# Altium schematic sheet Sheet_1.schdoc
size 303 x 213 mm
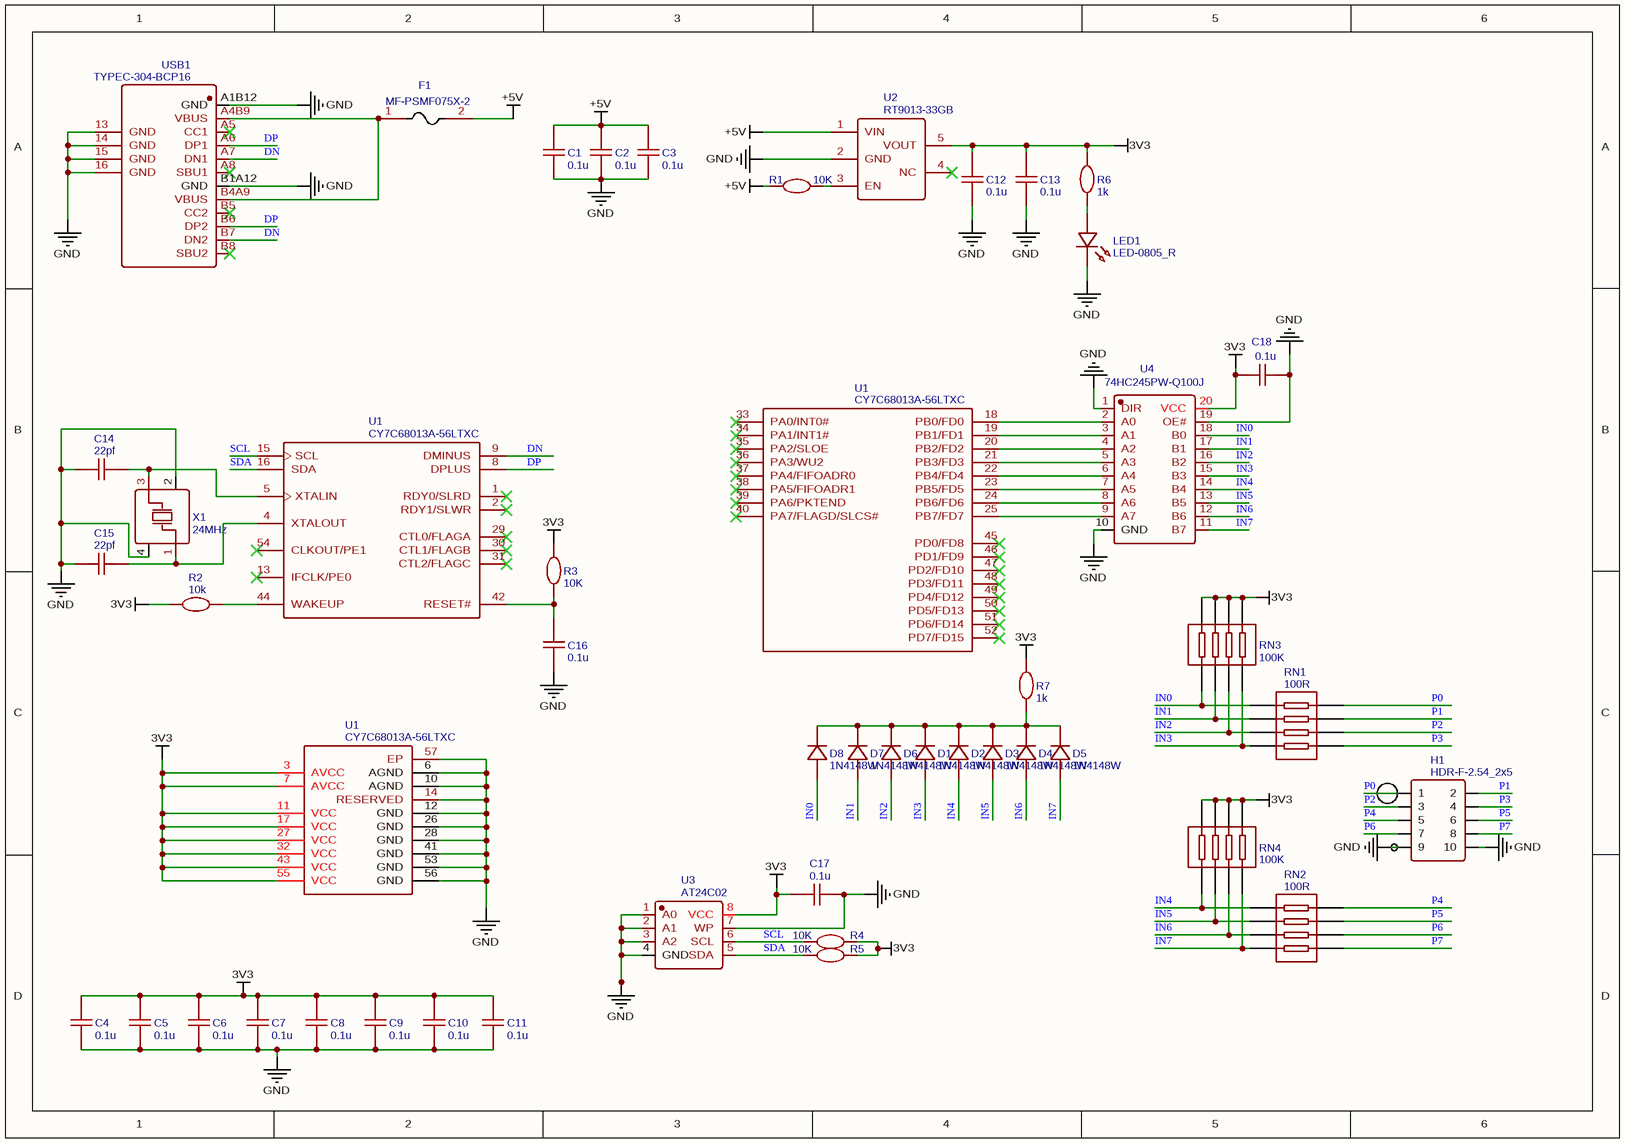
[diagram p0: Sheet_1.schdoc]

## Parts
(Parts that share a designator on the sheet are numbered #1, #2 ... from top to bottom, then left to right.)
C1  0.1u  [C0603]
C2  0.1u  [C0603]
C3  0.1u  [C0603]
C4  0.1u  [C0603]
C5  0.1u  [C0603]
C6  0.1u  [C0603]
C7  0.1u  [C0603]
C8  0.1u  [C0603]
C9  0.1u  [C0603]
C10  0.1u  [C0603]
C11  0.1u  [C0603]
C12  0.1u  [C0603]
C13  0.1u  [C0603]
C14  22pf  [C0603]
C15  22pf  [C0603]
C16  0.1u  [C0603]
C17  0.1u  [C0603]
C18  0.1u  [C0603]
D1  1N4148W  [SOD-123_L3.1-W1.7-LS3.7-RD]
D2  1N4148W  [SOD-123_L3.1-W1.7-LS3.7-RD]
D3  1N4148W  [SOD-123_L3.1-W1.7-LS3.7-RD]
D4  1N4148W  [SOD-123_L3.1-W1.7-LS3.7-RD]
D5  1N4148W  [SOD-123_L3.1-W1.7-LS3.7-RD]
D6  1N4148W  [SOD-123_L3.1-W1.7-LS3.7-RD]
D7  1N4148W  [SOD-123_L3.1-W1.7-LS3.7-RD]
D8  1N4148W  [SOD-123_L3.1-W1.7-LS3.7-RD]
F1  MF-PSMF075X-2  [F0805]
H1  HDR-F-2.54_2x5  [HDR-F-2.54_2X5]
LED1  LED-0805_R  [LED0805_RED]
R1  10K  [R0603]
R2  10k  [R0603]
R3  10K  [R0603]
R4  10K  [R0603]
R5  10K  [R0603]
R6  1k  [R0603]
R7  1k  [R0603]
RN1  100R  [RES-ARRAY-SMD_0603-8P-L3.2-W1.6-BL]
RN2  100R  [RES-ARRAY-SMD_0603-8P-L3.2-W1.6-BL]
RN3  100K  [RES-ARRAY-SMD_0603-8P-L3.2-W1.6-BL]
RN4  100K  [RES-ARRAY-SMD_0603-8P-L3.2-W1.6-BL]
U1#1  CY7C68013A-56LTXC  [QFN-56_L8.0-W8.0-P0.50-TL-EP]
U1#2  CY7C68013A-56LTXC  [QFN-56_L8.0-W8.0-P0.50-TL-EP]
U1#3  CY7C68013A-56LTXC  [QFN-56_L8.0-W8.0-P0.50-TL-EP]
U2  RT9013-33GB  [SOT-23-5_L3.0-W1.7-P0.95-LS2.8-BR]
U3  AT24C02  [SOP-8_L5.0-W4.0-P1.27-LS6.0-BL]
U4  74HC245PW-Q100J  [TSSOP-20_L6.5-W4.4-P0.65-LS6.4-BL]
USB1  TYPEC-304-BCP16  [USB-C-SMD_TYPEC-304-BCP16]
X1  24MHz  [OSC-SMD_4P-L3.2-W2.5-BL]

## Nets
3V3: C4.2 C5.2 C6.2 C7.2 C8.2 C9.2 C10.2 C11.2 C12.2 C13.2 C17.1 C18.1 R2.1 R3.2 R4.2 R5.2 R6.2 R7.2 RN3.5 RN3.6 RN3.7 RN3.8 RN4.5 RN4.6 RN4.7 RN4.8 U1#3.3(AVCC) U1#3.7(AVCC) U1#3.11(VCC) U1#3.17(VCC) U1#3.27(VCC) U1#3.32(VCC) U1#3.43(VCC) U1#3.55(VCC) U2.5(VOUT) U3.8(VCC) U4.20(VCC)
+5V: C1.2 C2.2 C3.2 F1.2 R1.1 U2.1(VIN)
GND: C1.1 C2.1 C3.1 C4.1 C5.1 C6.1 C7.1 C8.1 C9.1 C10.1 C11.1 C12.1 C13.1 C14.1 C15.1 C16.1 C17.2 C18.2 H1.9 H1.10 LED1.2 U1#3.6(AGND) U1#3.10(AGND) U1#3.12(GND) U1#3.14(RESERVED) U1#3.26(GND) U1#3.28(GND) U1#3.41(GND) U1#3.53(GND) U1#3.56(GND) U1#3.57(EP) U2.2(GND) U3.1(A0) U3.2(A1) U3.3(A2) U3.4(GND) U3.7(WP) U4.1(DIR) U4.10(GND) U4.19(OE#) USB1.13(GND) USB1.14(GND) USB1.15(GND) USB1.16(GND) USB1.A1B12(GND) USB1.B1A12(GND) X1.2(GND) X1.4(GND)
DN: U1#1.9(DMINUS) USB1.A7(DN1) USB1.B7(DN2)
DP: U1#1.8(DPLUS) USB1.A6(DP1) USB1.B6(DP2)
IN0: D8.2(A) RN1.5 RN3.1 U4.18(B0)
IN1: D7.2(A) RN1.6 RN3.2 U4.17(B1)
IN2: D6.2(A) RN1.7 RN3.3 U4.16(B2)
IN3: D1.2(A) RN1.8 RN3.4 U4.15(B3)
IN4: D2.2(A) RN2.5 RN4.1 U4.14(B4)
IN5: D3.2(A) RN2.6 RN4.2 U4.13(B5)
IN6: D4.2(A) RN2.7 RN4.3 U4.12(B6)
IN7: D5.2(A) RN2.8 RN4.4 U4.11(B7)
P0: H1.1 RN1.4
P1: H1.2 RN1.3
P2: H1.3 RN1.2
P3: H1.4 RN1.1
P4: H1.5 RN2.4
P5: H1.6 RN2.3
P6: H1.7 RN2.2
P7: H1.8 RN2.1
SCL: R4.1 U1#1.15(SCL) U3.6(SCL)
SDA: R5.1 U1#1.16(SDA) U3.5(SDA)
NetC14_2: C14.2 U1#1.5(XTALIN) X1.3(OSC2)
NetC15_2: C15.2 U1#1.4(XTALOUT) X1.1(OSC1)
NetC16_2: C16.2 R3.1 U1#1.42(RESET#)
NetD1_1: D1.1(K) D2.1(K) D3.1(K) D4.1(K) D5.1(K) D6.1(K) D7.1(K) D8.1(K) R7.1
NetF1_1: F1.1 USB1.A4B9(VBUS) USB1.B4A9(VBUS)
NetLED1_1: LED1.1 R6.1
NetR1_2: R1.2 U2.3(EN)
NetR2_2: R2.2 U1#1.44(WAKEUP)
NetU1#2_18: U1#2.18(PB0/FD0) U4.2(A0)
NetU1#2_19: U1#2.19(PB1/FD1) U4.3(A1)
NetU1#2_20: U1#2.20(PB2/FD2) U4.4(A2)
NetU1#2_21: U1#2.21(PB3/FD3) U4.5(A3)
NetU1#2_22: U1#2.22(PB4/FD4) U4.6(A4)
NetU1#2_23: U1#2.23(PB5/FD5) U4.7(A5)
NetU1#2_24: U1#2.24(PB6/FD6) U4.8(A6)
NetU1#2_25: U1#2.25(PB7/FD7) U4.9(A7)

Not connected (* = marked no-connect by the designer): U1#1 1(RDY0/SLRD)* 2(RDY1/SLWR)* 13(IFCLK/PE0)* 29(CTL0/FLAGA)* 30(CTL1/FLAGB)* 31(CTL2/FLAGC)* 54(CLKOUT/PE1)*; U1#2 33(PA0/INT0#)* 34(PA1/INT1#)* 35(PA2/SLOE)* 36(PA3/WU2)* 37(PA4/FIFOADR0)* 38(PA5/FIFOADR1)* 39(PA6/PKTEND)* 40(PA7/FLAGD/SLCS#)* 45(PD0/FD8)* 46(PD1/FD9)* 47(PD2/FD10)* 48(PD3/FD11)* 49(PD4/FD12)* 50(PD5/FD13)* 51(PD6/FD14)* 52(PD7/FD15)*; U2 4(NC)*; USB1 A5(CC1)* A8(SBU1)* B5(CC2)* B8(SBU2)*

## Library data of the parts
C1-C13 C16-C18 = 0.1u: nameAlias: Value(F); Contributor: LCEDA_Lib; spicePre: C; spiceSymbolName: C_0603_US
C14 C15 = 22pf: nameAlias: Value(F); Contributor: LCEDA_Lib; spicePre: C; spiceSymbolName: C_0603_US
D1-D8 = 1N4148W: Contributor: LCSC; BOM_Supplier: LCSC; BOM_Supplier Part: C1884539; BOM_Manufacturer Part: 1N4148W; spicePre: D; spiceSymbolName: 1N4148W
F1 = MF-PSMF075X-2: BOM_Manufacturer: BOURNS; BOM_Supplier: LCSC; BOM_Manufacturer Part: MF-PSMF075X-2; BOM_Supplier Part: C116173; spicePre: F; spiceSymbolName: MF-PSMF075X-2
H1 = HDR-F-2.54_2x5: Contributor: LCEDA_Lib; BOM_Supplier Part: C30419; BOM_Supplier: LCSC; spicePre: H; spiceSymbolName: HDR-F-2.54_2x5
LED1 = LED-0805_R: BOM_Manufacturer Part: 17-21SURC/S530-A3/TR8; Contributor: LCEDA_Lib; BOM_Supplier Part: C72037; spicePre: L; spiceSymbolName: LED-0805_R
R1 R3-R5 = 10K: Contributor: LCEDA_Lib; spicePre: R; spiceSymbolName: R_0603_EU
R2 = 10k: Contributor: LCEDA_Lib; spicePre: R; spiceSymbolName: R_0603_EU
R6 R7 = 1k: Contributor: LCEDA_Lib; spicePre: R; spiceSymbolName: R_0603_EU
RN1 RN2 = 100R: BOM_Manufacturer: RALEC; BOM_Manufacturer Part: RTA03-4D471JTP; nameAlias: Resistance (Ohms); BOM_Supplier: LCSC; BOM_Supplier Part: C102671; spicePre: R; spiceSymbolName: RTA03-4D471JTP
RN3 RN4 = 100K: BOM_Manufacturer: RALEC; BOM_Manufacturer Part: RTA03-4D471JTP; nameAlias: Resistance (Ohms); BOM_Supplier: LCSC; BOM_Supplier Part: C102671; spicePre: R; spiceSymbolName: RTA03-4D471JTP
U1#1-U1#3 = CY7C68013A-56LTXC: BOM_Manufacturer: CYPRESS; subpart_no: 1; BOM_Supplier: LCSC; BOM_Manufacturer Part: CY7C68013A-56LTXC; image: //image.lceda.cn/szlcsc/C14912.jpg; BOM_Supplier Part: C14912; spicePre: U; spiceSymbolName: CY7C68013A-56LTXC
U2 = RT9013-33GB: BOM_Manufacturer: RICHTEK; BOM_Paste Type: recommend; BOM_Supplier: LCSC; BOM_Manufacturer Part: RT9013-33GB; image: //image.lceda.cn/szlcsc/C47773.jpg; BOM_Supplier Part: C47773; spicePre: U; spiceSymbolName: RT9013-33GB
U3 = AT24C02: BOM_Manufacturer: IDCHIP; Contributor: LCSC; BOM_Supplier: LCSC; BOM_Supplier Part: C688857; BOM_Manufacturer Part: AT24C02; spicePre: U; spiceSymbolName: AT24C02
U4 = 74HC245PW-Q100J: BOM_Manufacturer: Nexperia; Contributor: LCSC; BOM_Supplier: LCSC; BOM_Supplier Part: C546760; BOM_Manufacturer Part: 74HC245PW-Q100J; spicePre: U; spiceSymbolName: 74HC245PW-Q100J
USB1 = TYPEC-304-BCP16: BOM_Manufacturer: XUNPU; Contributor: LCSC; BOM_Supplier: LCSC; BOM_Supplier Part: C720629; BOM_Manufacturer Part: TYPEC-304-BCP16; spicePre: U; spiceSymbolName: TYPEC-304-BCP16
X1 = 24MHz: BOM_Manufacturer: YXC; BOM_Manufacturer Part: X322524MRB4SI; nameAlias: Frequency; BOM_Paste Type: expand; BOM_Supplier: LCSC; BOM_Supplier Part: C70571; spicePre: X; spiceSymbolName: X322524MRB4SI